# Altium project Morpheus_bottom.PrjPcb
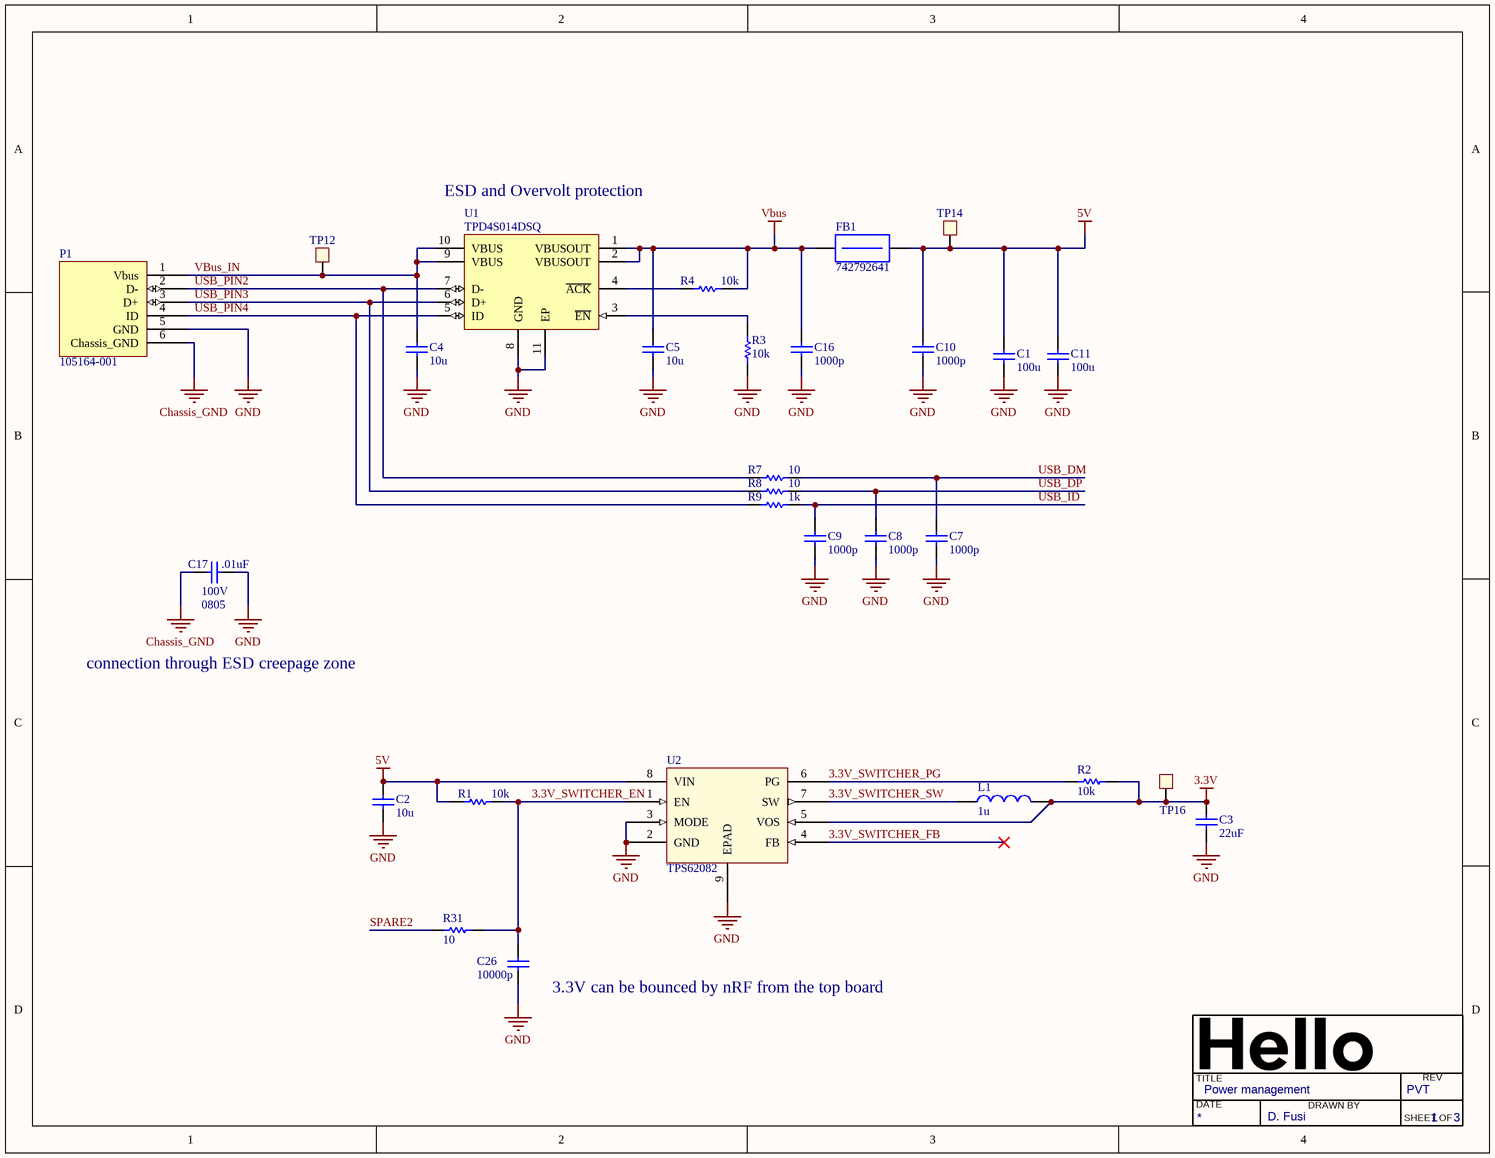
[diagram p0: Power_management.SchDoc]
3 sheets, 78 parts. Net scope: global (net labels, ports and power ports of the same name join across sheets).
Board file: Morpheus_bottom.PcbDoc
Sheets:
  Power_management.SchDoc
  Temperature_humidity.SchDoc
  Morpheus_bottom.SchDoc

## Sheet Power_management.SchDoc: Power management
size Letter; DrawnBy: D. Fusi; DocumentNumber: 1; Revision: PVT; SheetNumber: 1; SheetTotal: 3

### Parts
C1  100u  [CAP1206_SENSE_DVT]
C2  10u  [CAP0603_SENSE_DVT]
C3  22uF  [CAP1206_SENSE_DVT]
C4  10u  [CAP0603_SENSE_DVT]
C5  10u  [CAP0805_SENSE_DVT]
C7  1000p  [CAP0402_SENSE_DVT]
C8  1000p  [CAP0402_SENSE_DVT]
C9  1000p  [CAP0402_SENSE_DVT]
C10  1000p  [CAP0402_SENSE_DVT]
C11  100u  [CAP1206_SENSE_DVT]
C16  1000p  [CAP0402_SENSE_DVT]
C17  .01uF  Size: 0805  Voltage: 100V  [CAP0805_SENSE_DVT]
C26  10000p  [CAP0402_SENSE_DVT]
FB1  742792641  [RES0603_SENSE_DVT]
L1  1u  [INDC3030X13N]
P1  105164-001  [molex_105164-001]
R1  10k  [RES0402_SENSE_DVT]
R2  10k  [RES0402_SENSE_DVT]
R3  10k  [RES0402_SENSE_DVT]
R4  10k  [RES0402_SENSE_DVT]
R7  10  [RES0402_SENSE_DVT]
R8  10  [RES0402_SENSE_DVT]
R9  1k  [RES0402_SENSE_DVT]
R31  10  [RES0402_SENSE_DVT]
TP12  TP  [TP-1.1]  (value not drawn)
TP14  TP  [TP-1.1]  (value not drawn)
TP16  TP  [TP-1.1]  (value not drawn)
U1  TPD4S014DSQ  [DSQ10-1500X900TP]
U2  TPS62082  [QFN50P200X200X80_HS-9N]

### Nets
3.3V: C3.2 L1.2 R2.1 TP16.1 U2.5(VOS)
5V: C1.2 C2.2 C10.2 C11.2 FB1.2 R1.2 TP14.1 U2.8(VIN)
Chassis_GND: C17.1 P1.6(Chassis_GND)
GND: C1.1 C2.1 C3.1 C4.1 C5.1 C7.1 C8.1 C9.1 C10.1 C11.1 C16.1 C17.2 C26.1 P1.5(GND) R3.2 U1.8(GND) U1.11(EP) U2.2(GND) U2.3(MODE) U2.9(EPAD)
Vbus: C5.2 C16.2 FB1.1 R4.2 U1.1(VBUSOUT) U1.2(VBUSOUT)
3.3V_SWITCHER_EN: C26.2 R1.1 R31.2 U2.1(EN)
3.3V_SWITCHER_FB: U2.4(FB)
3.3V_SWITCHER_PG: R2.2 U2.6(PG)
3.3V_SWITCHER_SW: L1.1 U2.7(SW)
SPARE2: R31.1
USB_DM: C7.2 R7.1
USB_DP: C8.2 R8.1
USB_ID: C9.2 R9.2
USB_PIN2: P1.2(D-) R7.2 U1.7(D-)
USB_PIN3: P1.3(D+) R8.2 U1.6(D+)
USB_PIN4: P1.4(ID) R9.1 U1.5(ID)
VBus_IN: C4.2 P1.1(Vbus) TP12.1 U1.9(VBUS) U1.10(VBUS)
NetR3_1: R3.1 U1.3(~{EN})
NetR4_1: R4.1 U1.4(~{ACK})

### Notes on the sheet
- (near U1) ESD and Overvolt protection
- connection through ESD creepage zone
- (near C26) 3.3V can be bounced by nRF from the top board
- TITLE
- DATE
- DRAWN BY
- REV
- SHEET
- OF

### Library data of the parts
C1 C11 = C_100u_20_10_X5R_1206: CAP CER 10UF 10V 20% X5R 1206; Vendor: Taiyo Yuden; PN: LMK316BBJ107ML-T; Hello_PN: 225-00304; item_category: Capacitor; Value: 100u; Size: 1206; Tolerance: 20%; Voltage: 10V; Temp: X5R
C2 C4 = C_10u_20_10_X5R_0603: CAP CER 10UF 10V 20% X5R 0603; Vendor: Samsung; PN: CL10A106MP8NNNC; Hello_PN: 225-00397; Value: 10u; Size: 0603; Tolerance: 20%; Voltage: 10V; Temp: X5R
C3 = C_22u_20_10_X5R_1206: CAP CER 22UF 10V 20% X5R 1206; Value: 22u; Vendor: Yageo; PN: CC1206MKX5R6BB226; Hello_PN: 225-00368; item_category: Capacitor; Size: 1206; Tolerance: 20%; Voltage: 10V; Temp: X5R
C5 = C_10u_20_10_X7R_0805: CAP CER 10UF 10V 10% X7R 0805; Vendor: Samsung; PN: CL21B106KPQNNNE; Tolerance: 20%; Hello_PN: 225-00413; item_category: Capacitor; Value: 10u; Size: 0805; Voltage: 10V; Temp: X7R
C7-C10 C16 = C_1000p_10_50_X7R_0402: CAP CER 1000PF 50V 10% X7R 0402; Vendor: Yageo; PN: CC0402KRX7R9BB102; Hello_PN: 225-00272; item_category: Capacitor; Value: 1000p; Size: 0402; Tolerance: 10%; Voltage: 50V; Temp: X7R
C17 = C_10000p_10_100_X7R_0805: CAP CER 10000PF 100V X7R 0805; Vendor: TDK; PN: C2012X7R2A103K085AA; Tolerance: 10%; Hello_PN: 225-00307; item_category: Capacitor; Value: .01uF; Temp: X7R
C26 = C_10000p_10_50_X7R_0402: CAP CER 10000PF 50V 10% X7R 0402; Vendor: Yageo; PN: CC0402KRX7R9BB103; Voltage: 50; item_category: Capacitor; Hello_PN: 225-00349; Value: 10000p; Size: 0402; Tolerance: 10%; Temp: X7R
FB1 = FB_300_2_0.15_0603: FERRITE BEAD 300 OHM 2.0A 0603; Vendor: Wuerth; impedance at 100 MHz: 300; rated current: 2 A; DCR: 0.15 ohm; Hello_PN: 231-00206; PN: 742792641; item_category: Ferrite Bead
L1 = L_1u_20_?_0.39_1.4_2.5_1: SMD power inductor, 1uH; PN: XFL3012-102ME; Vendor: Coilcraft; Tolerance: 20%; RDC: 0.39; I_max: 2.5; I_sat: 1.4; Hello_PN: 230-00357; Value: 1u; Q: ?
P1 = molex_105164-001: Molex right-angle reverse flangeless USB Mini-B OTG receptacle; Hello_PN: 280-00265; item_category: Connector; PN: 105164-001; Vendor: Molex
R1-R4 = R_10k_5_0.1_0402: RES SMD 10K OHM 5% 1/16W 0402; Vendor: Yageo; PN: RC0402JR-0710KL; Hello_PN: 220-00409; item_category: Resistor; Model: *; Value: 10k; Tolerance: 5 %; Power: 1/16W; Size: 0402
R7 R8 R31 = R_10_1_0.1_0402: RES SMD 10 OHM 1% 1/16W 0402; Vendor: Yageo; PN: RC0402FR-0710RL; Hello_PN: 220-00405; item_category: Resistor; Model: *; Value: 10; Tolerance: 1 %; Power: 1/16W; Size: 0402
R9 = R_1k_1_0.1_0402: RES SMD 1K OHM 1% 1/16W 0402; Vendor: Yageo; PN: RC0402FR-071KL; item_category: Resistor; Hello_PN: 220-00402; Model: *; Value: 1k; Tolerance: 1 %; Power: 1/16W; Size: 0402
TP12 TP14 TP16 = TP: testpoint
U1 = TPD4S014DSQ: TPD4S014 USB Charger Port Protection Including ESD Protection for all Lines and Over Voltage Protection on VBUS. D+/D-/ID pins are interchangable.; Vendor: Texas Instruments; Hello_PN: 260-00375; item_category: IC Analog; Supplier 1: Digi-Key; Supplier Part Number 1: 296-29093-1-ND; PN: TPD4S014DSQ
U2 = TPS62082: 1.2A buck converter with snoozemode; Vendor: TI; Hello_PN: 260-00360; item_category: IC Analog; PN: TPS62082

## Sheet Temperature_humidity.SchDoc: Temperature / Humidity
size Letter; DrawnBy: D. Fusi; DocumentNumber: 2; Revision: PVT; SheetNumber: 2; SheetTotal: 3
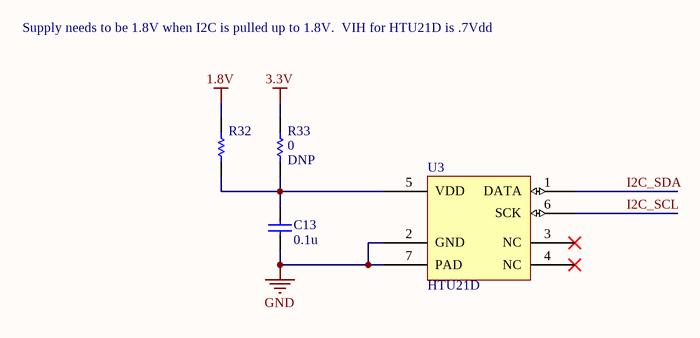
[diagram p1: Temperature_humidity.SchDoc]

### Parts
C13  0.1u  [CAP0603]
R32  R_0_jumper_0.1_0402  [RES0402-SENSE-DVT]  (value not drawn)
R33  DNP  value 0  [RES0402-SENSE-DVT]
U3  HTU21D  [HTU2xx]

### Nets
1.8V: R32.2
3.3V: R33.2
GND: C13.1 U3.2(GND) U3.7(PAD)
I2C_SCL: U3.6(SCK)
I2C_SDA: U3.1(DATA)
NetC13_2: C13.2 R32.1 R33.1 U3.5(VDD)

Not connected (* = marked no-connect by the designer): U3 3(NC)* 4(NC)*

### Notes on the sheet
- Supply needs to be 1.8V when I2C is pulled up to 1.8V.  VIH for HTU21D is .7Vdd
- TITLE
- DATE
- DRAWN BY
- REV
- SHEET
- OF

### Library data of the parts
C13 = C_0.1u_10_50_X7R_0603: CAP CER 0.1UF 50V 10% X7R 0603; Vendor: Yageo; PN: CC0603KRX7R9BB104; Hello_PN: 225-00041; item_category: Capacitor; Value: 0.1u; Size: 0603; Tolerance: 10%; Voltage: 50V; Temp: X7R
R32 = R_0_jumper_0.1_0402: RES SMD 0.0 OHM JUMPER 1/16W; Value: 0; Vendor: Yageo; PN: RC0402JR-070RL; Hello_PN: 220-00408; item_category: Resistor; Model: *; Tolerance: Jumper; Power: 1/16W; Size: 0402
R33 = R_0_jumper_0.1_0402: RES SMD 0.0 OHM JUMPER 1/16W; Vendor: Yageo; PN: RC0402JR-070RL; Hello_PN: 220-00408; item_category: Resistor; Model: *; Tolerance: Jumper; Power: 1/16W; Size: 0402
U3 = HTU21D: Meas-spec T/H sensor; Vendor: Measurement specialties; Hello_PN: 265-00196; item_category: IC Mixed Signal; PN: HTU21D

## Sheet Morpheus_bottom.SchDoc: Morpheus_bottom
size Letter; DrawnBy: D. Fusi; DocumentNumber: 3; Revision: PVT; SheetNumber: 3; SheetTotal: 3
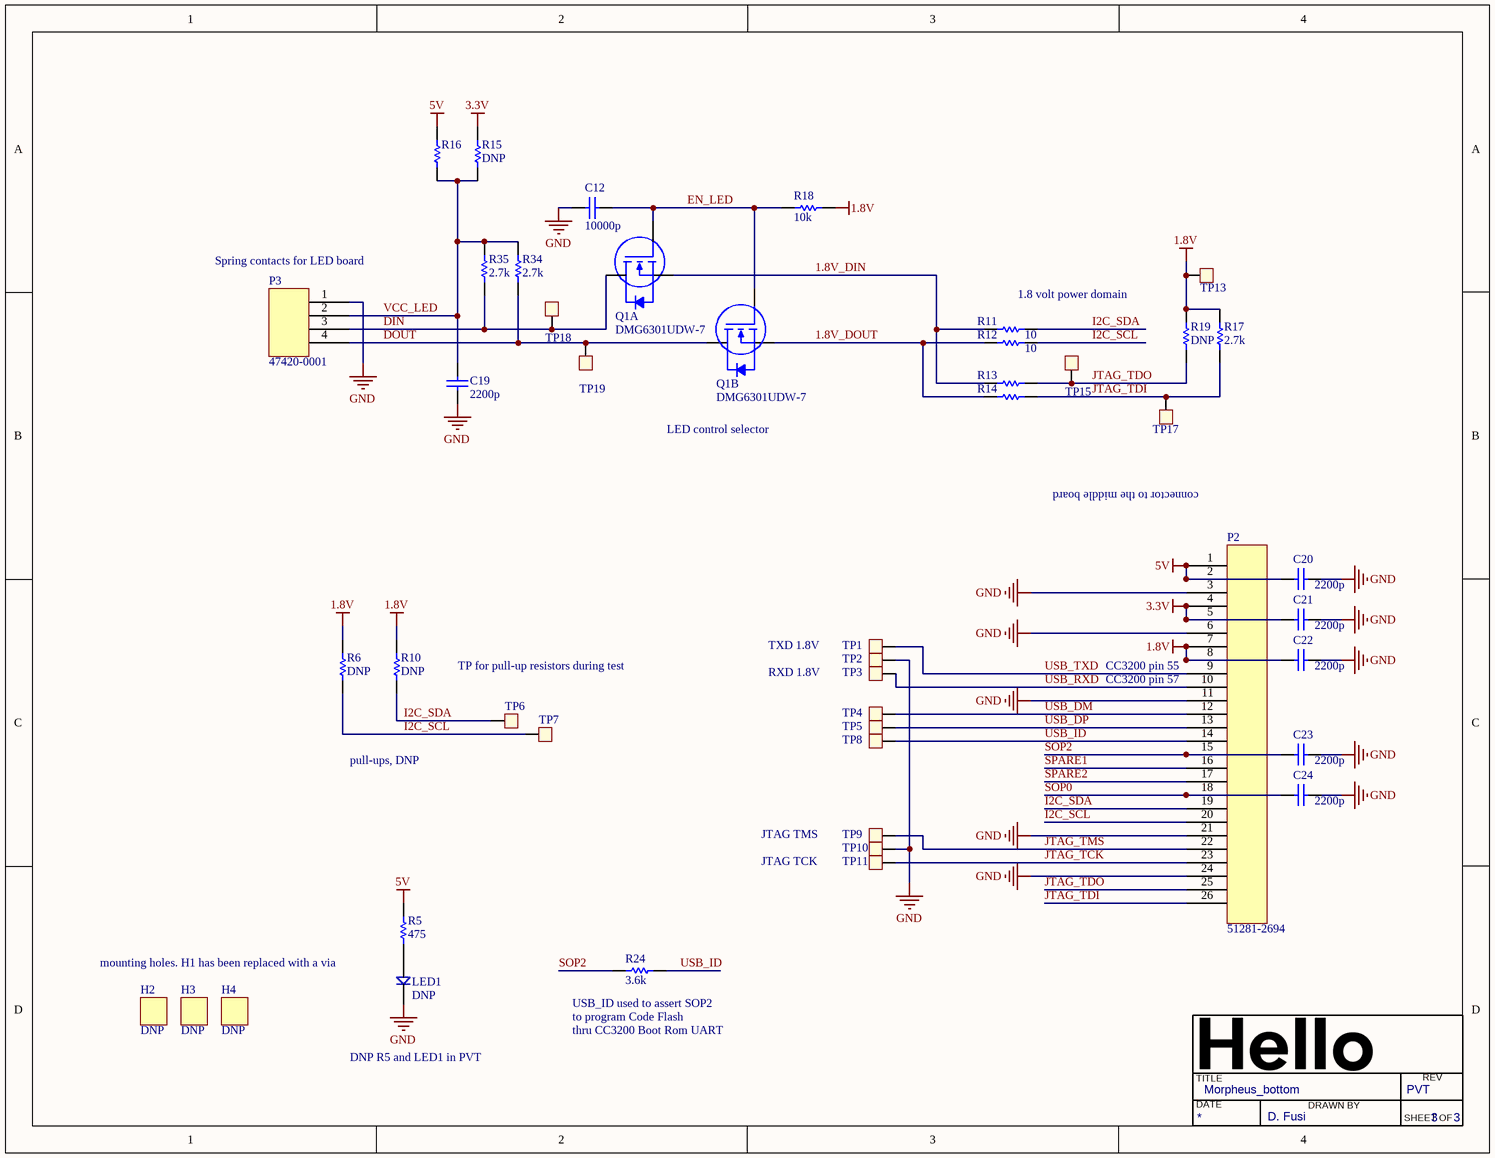
[diagram p2: Morpheus_bottom.SchDoc]

### Parts
C12  10000p  [CAP0603_SENSE_DVT]
C19  2200p  [CAP0402_SENSE_DVT]
C20  2200p  [CAP0402_SENSE_DVT]
C21  2200p  [CAP0402_SENSE_DVT]
C22  2200p  [CAP0402_SENSE_DVT]
C23  2200p  [CAP0402_SENSE_DVT]
C24  2200p  [CAP0402_SENSE_DVT]
H2  DNP  [HOLE_ROUND_1.8mm]
H3  DNP  [HOLE_ROUND_1.8mm]
H4  DNP  [HOLE_ROUND_1.8mm]
LED1  DNP  [LED_Kingbright]
P2  51281-2694  [molex_51281-2694_reverse]
P3  47420-0001  [molex_47420-0001]
Q1  DMG6301UDW-7  [SC-70-6]  (parts A,B of 2)
R5  475  [RES0402_SENSE_DVT]
R6  DNP  [RES0603_SENSE_DVT]
R10  DNP  [RES0603_SENSE_DVT]
R11  10  [RES0402_SENSE_DVT]
R12  10  [RES0402_SENSE_DVT]
R13  R_0_jumper_0.1_0402  [RES0402-SENSE-DVT]  (value not drawn)
R14  R_0_jumper_0.1_0402  [RES0402-SENSE-DVT]  (value not drawn)
R15  DNP  [RES0603_SENSE_DVT]
R16  R_0_jumper_0.1_0402  [RES0402-SENSE-DVT]  (value not drawn)
R17  2.7k  [RES0402_SENSE_DVT]
R18  10k  [RES0402_SENSE_DVT]
R19  DNP  [RES0402_SENSE_DVT]
R24  3.6k  [RES0402_SENSE_DVT]
R34  2.7k  [RES0402_SENSE_DVT]
R35  2.7k  [RES0402_SENSE_DVT]
TP1  TP  [TP-1.1]  (value not drawn)
TP2  TP  [TP-1.1]  (value not drawn)
TP3  TP  [TP-1.1]  (value not drawn)
TP4  TP  [TP-1.1]  (value not drawn)
TP5  TP  [TP-1.1]  (value not drawn)
TP6  TP  [TP-1.1]  (value not drawn)
TP7  TP  [TP-1.1]  (value not drawn)
TP8  TP  [TP-1.1]  (value not drawn)
TP9  TP  [TP-1.1]  (value not drawn)
TP10  TP  [TP-1.1]  (value not drawn)
TP11  TP  [TP-1.1]  (value not drawn)
TP13  TP  [TP-1.1]  (value not drawn)
TP15  TP  [TP-1.1]  (value not drawn)
TP17  TP  [TP-1.1]  (value not drawn)
TP18  TP  [TP-1.1]  (value not drawn)
TP19  TP  [TP-1.1]  (value not drawn)

### Nets
1.8V: C22.1 P2.7 P2.8 R6.2 R10.2 R17.2 R18.2 R19.2 TP13.1
3.3V: C21.1 P2.4 P2.5 R15.2
5V: C20.1 P2.1 P2.2 R5.2 R16.2
GND: C12.2 C19.1 C20.2 C21.2 C22.2 C23.2 C24.2 LED1.2(Cathode) P2.3 P2.6 P2.11 P2.21 P2.24 P3.1 TP2.1 TP10.1
1.8V_DIN: Q1.1(S1) R11.2 R13.1
1.8V_DOUT: Q1.4(S2) R12.2 R14.1
DIN: P3.3 Q1.6(D1) R35.1 TP18.1
DOUT: P3.4 Q1.3(D2) R34.1 TP19.1
EN_LED: C12.1 Q1.2(G1) Q1.5(G2) R18.1
I2C_SCL: P2.20 R6.1 R12.1 TP7.1
I2C_SDA: P2.19 R10.1 R11.1 TP6.1
JTAG_TCK: P2.23 TP11.1
JTAG_TDI: P2.26 R14.2 R17.1 TP17.1
JTAG_TDO: P2.25 R13.2 R19.1 TP15.1
JTAG_TMS: P2.22 TP9.1
SOP0: C24.1 P2.18
SOP2: C23.1 P2.15 R24.1
SPARE1: P2.16
SPARE2: P2.17
USB_DM: P2.12 TP4.1
USB_DP: P2.13 TP5.1
USB_ID: P2.14 R24.2 TP8.1
USB_RXD: P2.10 TP3.1
USB_TXD: P2.9 TP1.1
VCC_LED: C19.2 P3.2 R15.1 R16.1 R34.2 R35.2
NetLED1_1: LED1.1(Anode) R5.1

### Notes on the sheet
- (near P3) Spring contacts for LED board
- 1.8 volt power domain
- LED control selector
- connector to the middle board
- TP for pull-up resistors during test
- TXD 1.8V
- RXD 1.8V
- (near P2) CC3200 pin 55
- (near P2) CC3200 pin 57
- pull-ups, DNP
- JTAG TMS
- JTAG TCK
- mounting holes. H1 has been replaced with a via
- (near R24) USB_ID used to assert SOP2
- thru CC3200 Boot Rom UART
- (near R24) to program Code Flash
- DNP R5 and LED1 in PVT
- TITLE
- DATE
- DRAWN BY
- REV
- SHEET
- OF

### Library data of the parts
C12 = C_10000p_10_50_X7R_0603: CAP CER 10000PF 50V 10% X7R 0603; Vendor: Yageo; PN: CC0603KRX7R9BB103; Voltage: 50; Hello_PN: 225-00355; item_category: Capacitor; Value: 10000p; Size: 0603; Tolerance: 10%; Temp: X7R
C19-C24 = C_2200p_5_16_STD_0402: CAP CER 2200PF 16V 10% X7R 0402; Vendor: Taiyo Yuden; PN: GRM155R71C222KA01D; Temp: Standard; Hello_PN: 225-00417; item_category: Capacitor; Value: 2200p; Size: 0402; Tolerance: 10 %; Voltage: 16V
H2-H4 = Hole: general purpose hole
LED1 = APT2012SGC: Kingbright Green SMT LED
P2 = 51281-011: Molex 26-pin 0.5mm pitch connector; PN: 51281-2694; Vendor: Molex
P3 = molex_47420-0001: Molex 4-pin spring connector 1.8 mm working height; Hello_PN: 280-00273; PN: 47420-0001; Vendor: Molex; item_category: Connector
Q1 = DMG6301UDW-7: MOSFET 2N-CH 25V 240MA SOT363; Vendor: Diodes Inc.; Hello_PN: 240-00358; item_category: Transistor; PN: DMG6301UDW-7
R5 = R_475_1_0.1_0402: RES SMD 475 OHM 1% 1/16W 0402; Vendor: Yageo; Power: 0.1 W; PN: RC0402FR-07475RL; Hello_PN: 220-00456; item_category: Resistor; Model: *; Value: 475; Tolerance: 1 %; Size: 0402
R6 R10 R15 = R_2.7k_1_0.1_0603: Chip Resistor; Value: 2.7k; Vendor: Panasonic; Tolerance: 1 %; Power: 0.1 W; PN: ERJ-3EKF2701V; Model: *; Size: 0603
R11 R12 = R_10_1_0.1_0402: as R7 on sheet Power_management; Model: *; Value: 10; Tolerance: 1 %; Power: 1/16W; Size: 0402
R13 R14 R16 = R_0_jumper_0.1_0402: as R32 on sheet Temperature_humidity; Model: *; Tolerance: Jumper; Power: 1/16W; Size: 0402
R17 R19 R34 R35 = R_2.7k_5_0.1_0402: RES SMD 2.7K OHM 5% 1/16W 0402; Vendor: Yageo; PN: RC0402JR-072K7L; Hello_PN: 220-00446; Model: *; Value: 2.7k; Tolerance: 5 %; Power: 1/16W; Size: 0402
R18 = R_10k_5_0.1_0402: as R1 on sheet Power_management; Model: *; Value: 10k; Tolerance: 5 %; Power: 1/16W; Size: 0402
R24 = R_3.6k_1_0.1_0402: RES SMD 3.6K OHM 1% 1/16W 0402; Vendor: Yageo; PN: RC0402FR-073K6L; Hello_PN: 220-00444; item_category: Resistor; Model: *; Value: 3.6k; Tolerance: 1 %; Power: 1/16W; Size: 0402
TP1-TP11 TP13 TP15 TP17-TP19 = TP: testpoint

## Nets that join several sheets
1.8V: Temperature_humidity (R32.2), Morpheus_bottom (9 pins)
3.3V: Power_management (5 pins), Temperature_humidity (R33.2), Morpheus_bottom (C21.1 P2.4 P2.5 R15.2)
5V: Power_management (8 pins), Morpheus_bottom (5 pins)
GND: Power_management (20 pins), Temperature_humidity (C13.1 U3.2 U3.7), Morpheus_bottom (16 pins)
I2C_SCL: Temperature_humidity (U3.6), Morpheus_bottom (P2.20 R6.1 R12.1 TP7.1)
I2C_SDA: Temperature_humidity (U3.1), Morpheus_bottom (P2.19 R10.1 R11.1 TP6.1)
SPARE2: Power_management (R31.1), Morpheus_bottom (P2.17)
USB_DM: Power_management (C7.2 R7.1), Morpheus_bottom (P2.12 TP4.1)
USB_DP: Power_management (C8.2 R8.1), Morpheus_bottom (P2.13 TP5.1)
USB_ID: Power_management (C9.2 R9.2), Morpheus_bottom (P2.14 R24.2 TP8.1)